# EAGLE schematic test (EAGLE 7.6.0)
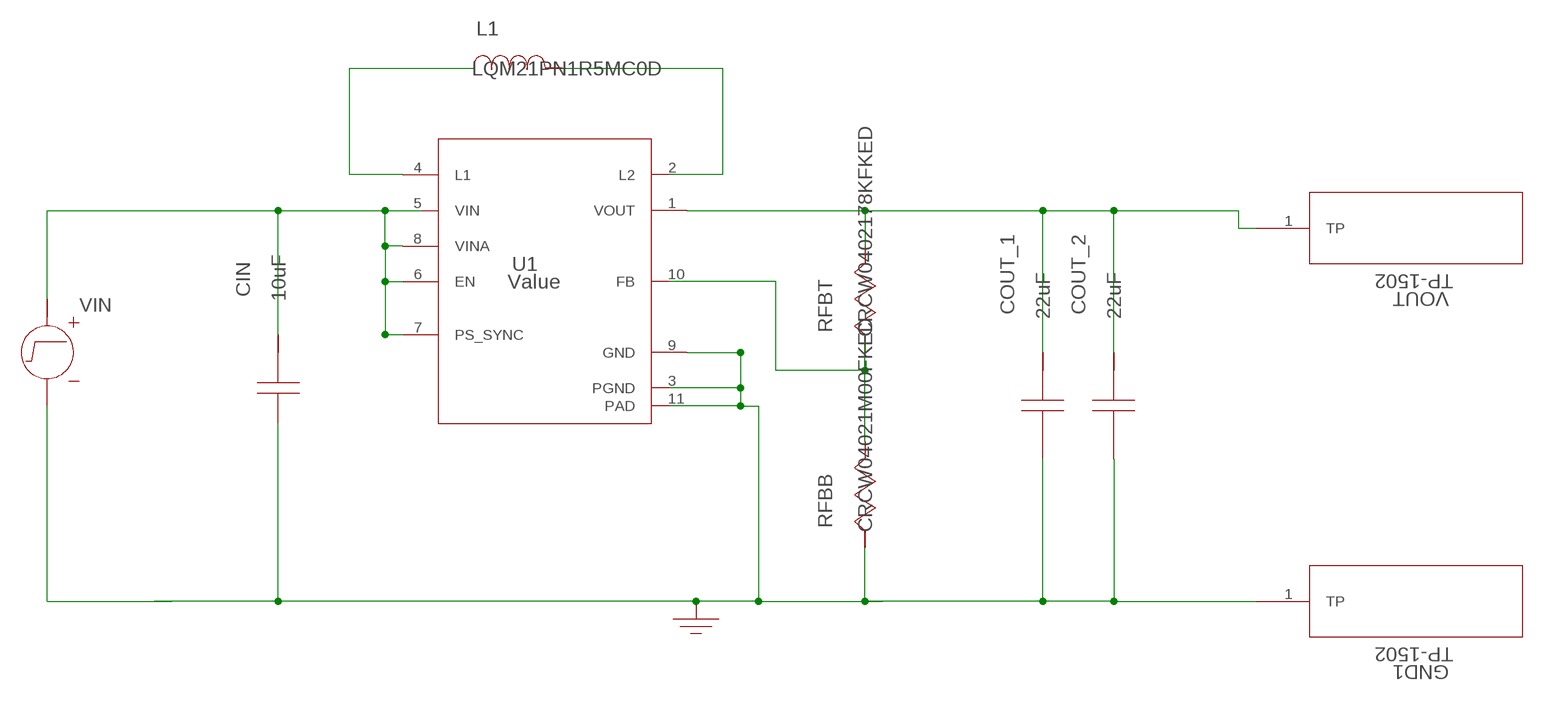
[diagram p0: schematic, sheet 1]

## Parts
CIN  10uF  LMK212BJ106KG-T  [LMK212BJ106KG-T]
COUT_1  22uF  LMK212BJ226MG-T  [0805]
COUT_2  22uF  LMK212BJ226MG-T  [0805]
GND  WB_GND  WB_GNDWB_GND  [WB_GND]
GND1  TP-1502  [TP-1502]
L1  LQM21PN1R5MC0D  [LQM21PN1R5MC0D]
RFBB  CRCW04021M00FKED  [0402]
RFBT  CRCW0402178KFKED  [CRCW0402178KFKED]
U1  Value  TPS63000DRCR  [DRC0010J]
VIN  WB_STARTUP_VOLTAGE_SOURCE  WB_STARTUP_VOLTAGE_SOURCEWB_STARTUP_VOLTAGE_SOURCE  [WB_STARTUP_VOLTAGE_SOURCE]
VOUT  TP-1502  [TP-1502]

## Nets
1: CIN.1 U1.5(VIN) U1.6(EN) U1.7(PS_SYNC) U1.8(VINA) VIN.1(+)
GND1: COUT_1.2 COUT_2.2 GND1.1(TP) RFBB.2 U1.9(GND) VIN.2(-)
GND2: GND.1
N$2: U1.4(L1)
N$3: L1.2
N$4: COUT_1.1 COUT_2.1 RFBT.1 U1.1(VOUT) VOUT.1(TP)
N$6: RFBB.1
Unconnected: CIN.2 L1.1 RFBT.2 U1.2(L2) U1.10(FB)

## Power pins joined to a net without a drawn wire
PAD: U1.11(PAD)
PGND: U1.3(PGND)

## Library data of the parts
CIN = sps:LMK212BJ106KG-T
COUT_1 COUT_2 = sps:LMK212BJ226MG-T
GND = AcceleratedDesigns_Lib:WB_GND; MANUFACTURER_NAME: WB_GND; MANUFACTURER_PART_NUMBER: WB_GND; POWERPORTTYPE: POWER_GROUND; VALUE: Value
GND1 VOUT = sps:TP-1502
L1 = sps:LQM21PN1R5MC0D
RFBB = sps:CRCW04021M00FKED
RFBT = sps:CRCW0402178KFKED
U1 = sps:TPS63000DRCR; COMPTYPE: IC; MANUFACTURER: Texas Instruments; MOUNTTYPE: SMT; PACKAGEREFERENCE: DRC0010A; PARTNUMBER: TPS63000DRC; PIN_COUNT: 11; REFDES: RefDes; ROHS: Y; TYPE: TYPE
VIN = AcceleratedDesigns_Lib:WB_STARTUP_VOLTAGE_SOURCE; MANUFACTURER_NAME: WB_STARTUP_VOLTAGE_SOURCE; MANUFACTURER_PART_NUMBER: WB_STARTUP_VOLTAGE_SOURCE; POWERPORTTYPE: POWER_GROUND; VALUE: Value